# EAGLE design 3310JACKBOARD (EAGLE 9.6.2)
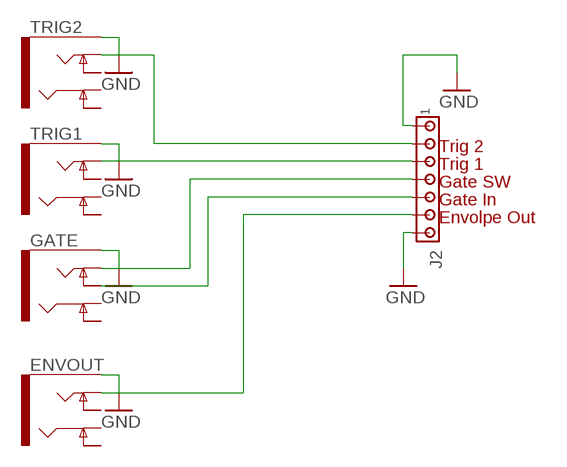
[diagram p0: schematic, sheet 1]

## Parts
ENVOUT  AUDIO_JACK_TRS_0.25"_PTH_VERTICAL  [AUDIO_JACK_0.25"_TRS_PTH_VERTICAL]
GATE  AUDIO_JACK_TRS_0.25"_PTH_VERTICAL  [AUDIO_JACK_0.25"_TRS_PTH_VERTICAL]
J2  MTA07-100  [10X07MTA]
TRIG1  AUDIO_JACK_TRS_0.25"_PTH_VERTICAL  [AUDIO_JACK_0.25"_TRS_PTH_VERTICAL]
TRIG2  AUDIO_JACK_TRS_0.25"_PTH_VERTICAL  [AUDIO_JACK_0.25"_TRS_PTH_VERTICAL]

## Nets
GND: ENVOUT.SLEEVE(EARTH) GATE.SLEEVE(EARTH) J2.1 J2.7 TRIG1.SLEEVE(EARTH) TRIG2.SLEEVE(EARTH)
N$22: ENVOUT.TIP J2.6
N$32: GATE.TIP-NORM J2.5
N$35: GATE.TIP J2.4
N$37: J2.3 TRIG1.TIP
N$38: J2.2 TRIG2.TIP
Unconnected: ENVOUT.RING ENVOUT.RING-NORM ENVOUT.TIP-NORM GATE.RING GATE.RING-NORM TRIG1.RING TRIG1.RING-NORM TRIG1.TIP-NORM TRIG2.RING TRIG2.RING-NORM TRIG2.TIP-NORM

## Notes on the sheet
- Trig 2
- Trig 1
- Gate SW
- Gate In
- Envolpe Out

## Library data of the parts
ENVOUT GATE TRIG1 TRIG2 = SparkFun-Retired:AUDIO_JACK_TRS_0.25"_PTH_VERTICAL: Audio Jack, 1/4" TRS jack, VERTICLEl, PTH, aka "Phono jack" Note, this footprint is UN-proven. It has not yet been used by SparkFun on a design.; PROD_ID: COM-11152
J2 = con-amp:MTA07-100: AMP connector

## Net classes
0 default: width 0.711 mm

## Board
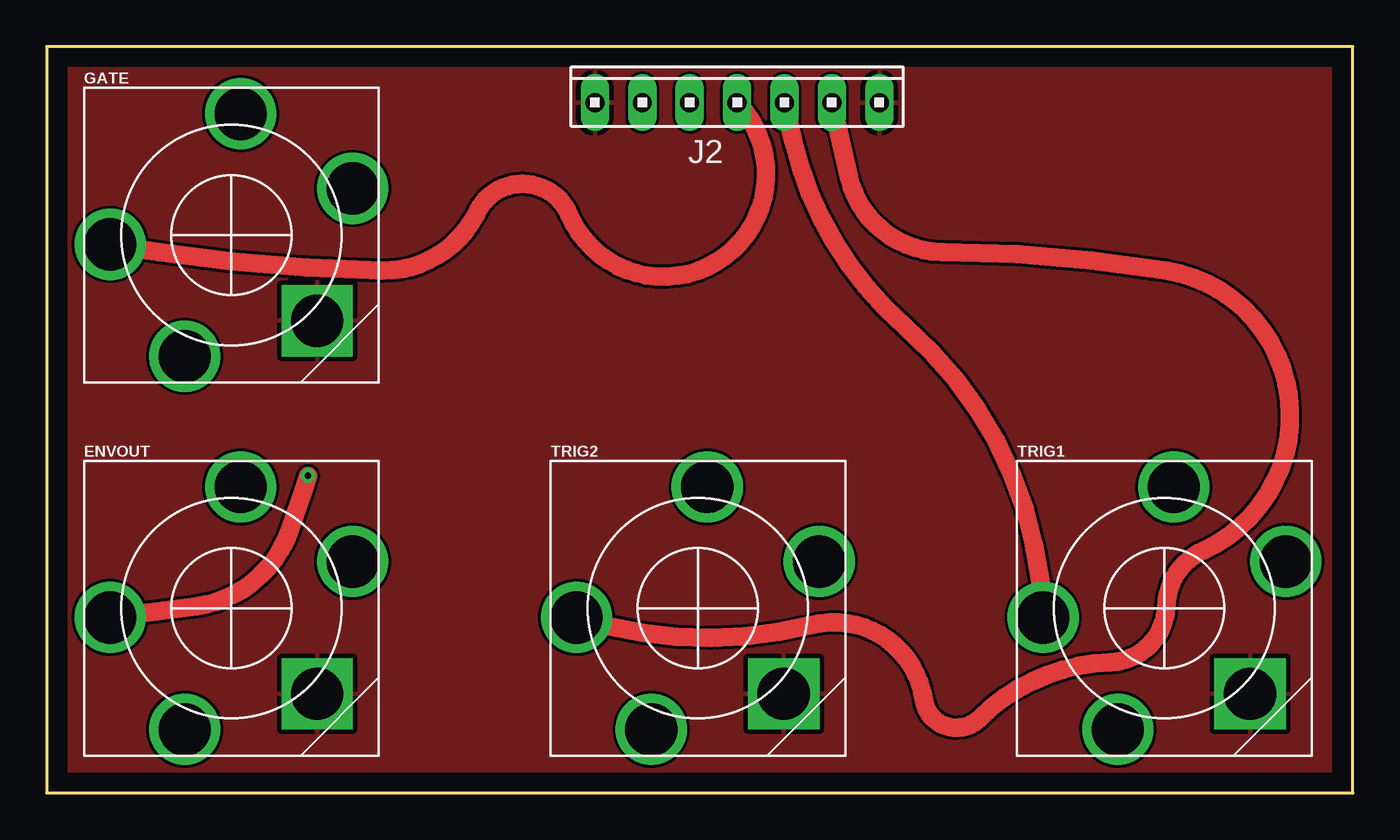
[diagram p1: board, top side]
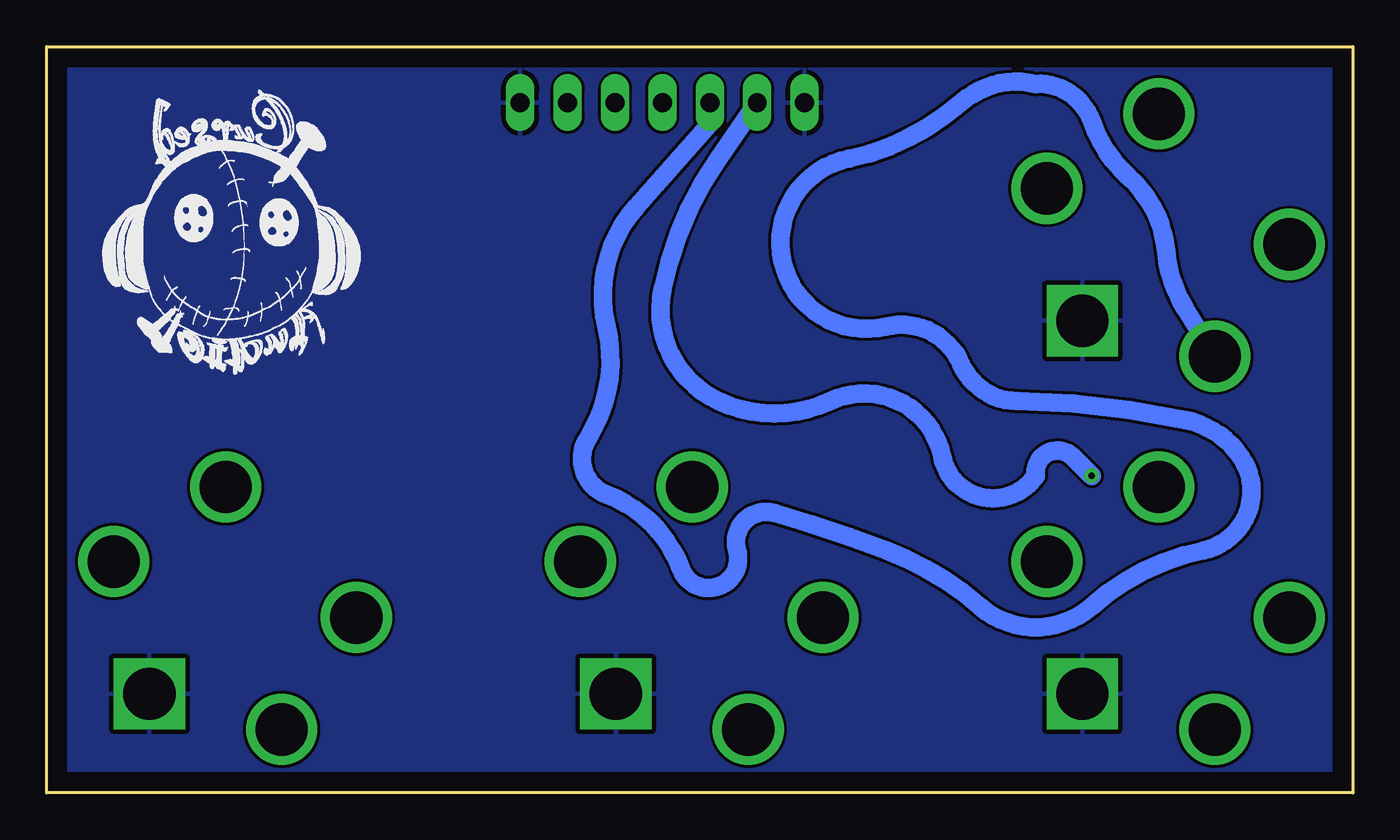
[diagram p2: board, bottom side, seen from below]

Size 70 x 40 mm. Coordinates in mm from the lower left corner, seen from the top.
Outline: 70,0 70,40 0,40 0,0 70,0
Copper layers (1*16): Top 0.035mm / dielectric 1.5mm / Bottom 0.035mm
Design rules "default": minimum track width 6mil, minimum drill 0.35mm, track to track 6mil, track to pad 6mil, pad to pad 6mil, via to via 6mil, smd to smd 6mil, copper to edge 40mil, drill to drill 6mil, minimum pad ring 10mil, minimum via ring 8mil, stop-mask expansion 4mil, vias tented up to drill 0mil, thermal gap 10mil

### Footprints (pad centres in the part's own frame; a part is rotated, then mirrored left to right if it is on the bottom)
AUDIO_JACK_0.25"_TRS_PTH_VERTICAL = drill 2.8: RING 8.4,14.4; RING-NORM 14.4,10.4; TIP 1.4,7.4; TIP-NORM 5.4,1.4 | drill 2.8 square: SLEEVE 12.496,3.304
10X07MTA = drill 1.016 long: 1 7.62,0; 2 5.08,0; 3 2.54,0; 4 0,0; 5 -2.54,0; 6 -5.08,0; 7 -7.62,0

### Placement (x,y rotation side)
ENVOUT  2,2 0 top
GATE  2,22 0 top
J2  37,37 0 top
TRIG1  52,2 0 top
TRIG2  27,2 0 top
U$1  [CA]  64.32,27.33 0 top

### Tracks (layer width: path | path; a pad name or v marks a point on that pad's centre or on a via)
GND
  pour Top: 0,40 0,0 70,0 70,40
  pour Bottom: 0,40 0,0 70,0 70,40
N$22  (via drill 0.35)
  Top 1: ENVOUT.TIP 8,10 arc62 13,14 arc3 v14,17
  Bottom 1: J2.6 34,34 arc-23 37,27 arc-76 34,21 arc-50 28,21 arc104 22,18 arc-134 17,17 arc143 15,18 v14,17
N$32
  Bottom 1: J2.5 34.46,35.87 38.39,31.43 arc-55 40,25 arc46 41,19 arc-102 40,16 arc48 36,12 arc-175 33,13 arc122 31,15 arc5 25,13 arc20 20,10 arc-82 14,10 arc29 8,13 arc-112 6,18 arc-44 9,20 arc-11 18,21 arc66 21,23 arc-80 25,25 arc182 27,34 arc-30 21,37 arc55 17,38 arc74 14,36 arc-28 12,33 arc43 10,29 arc-26 9,26 GATE.TIP-NORM
N$35
  Top 1: J2.4 arc-201 28,31 arc134 23,31 arc-63 18,28 arc-8 6,29 GATE.TIP
N$37
  Top 1: J2.3 40,35 arc36 46,25 arc-47 TRIG1.TIP
N$38
  Top 1: J2.2 43,33 arc77 48,29 arc-9 60,28 arc-146 62,13 arc64 60,10 arc-86 57,7 arc43 50,4 arc-126 47,5 arc96 41,9 arc-32 TRIG2.TIP